# Altium project QSFP28 Mezzanine.PrjPcb (part 4 of 4)
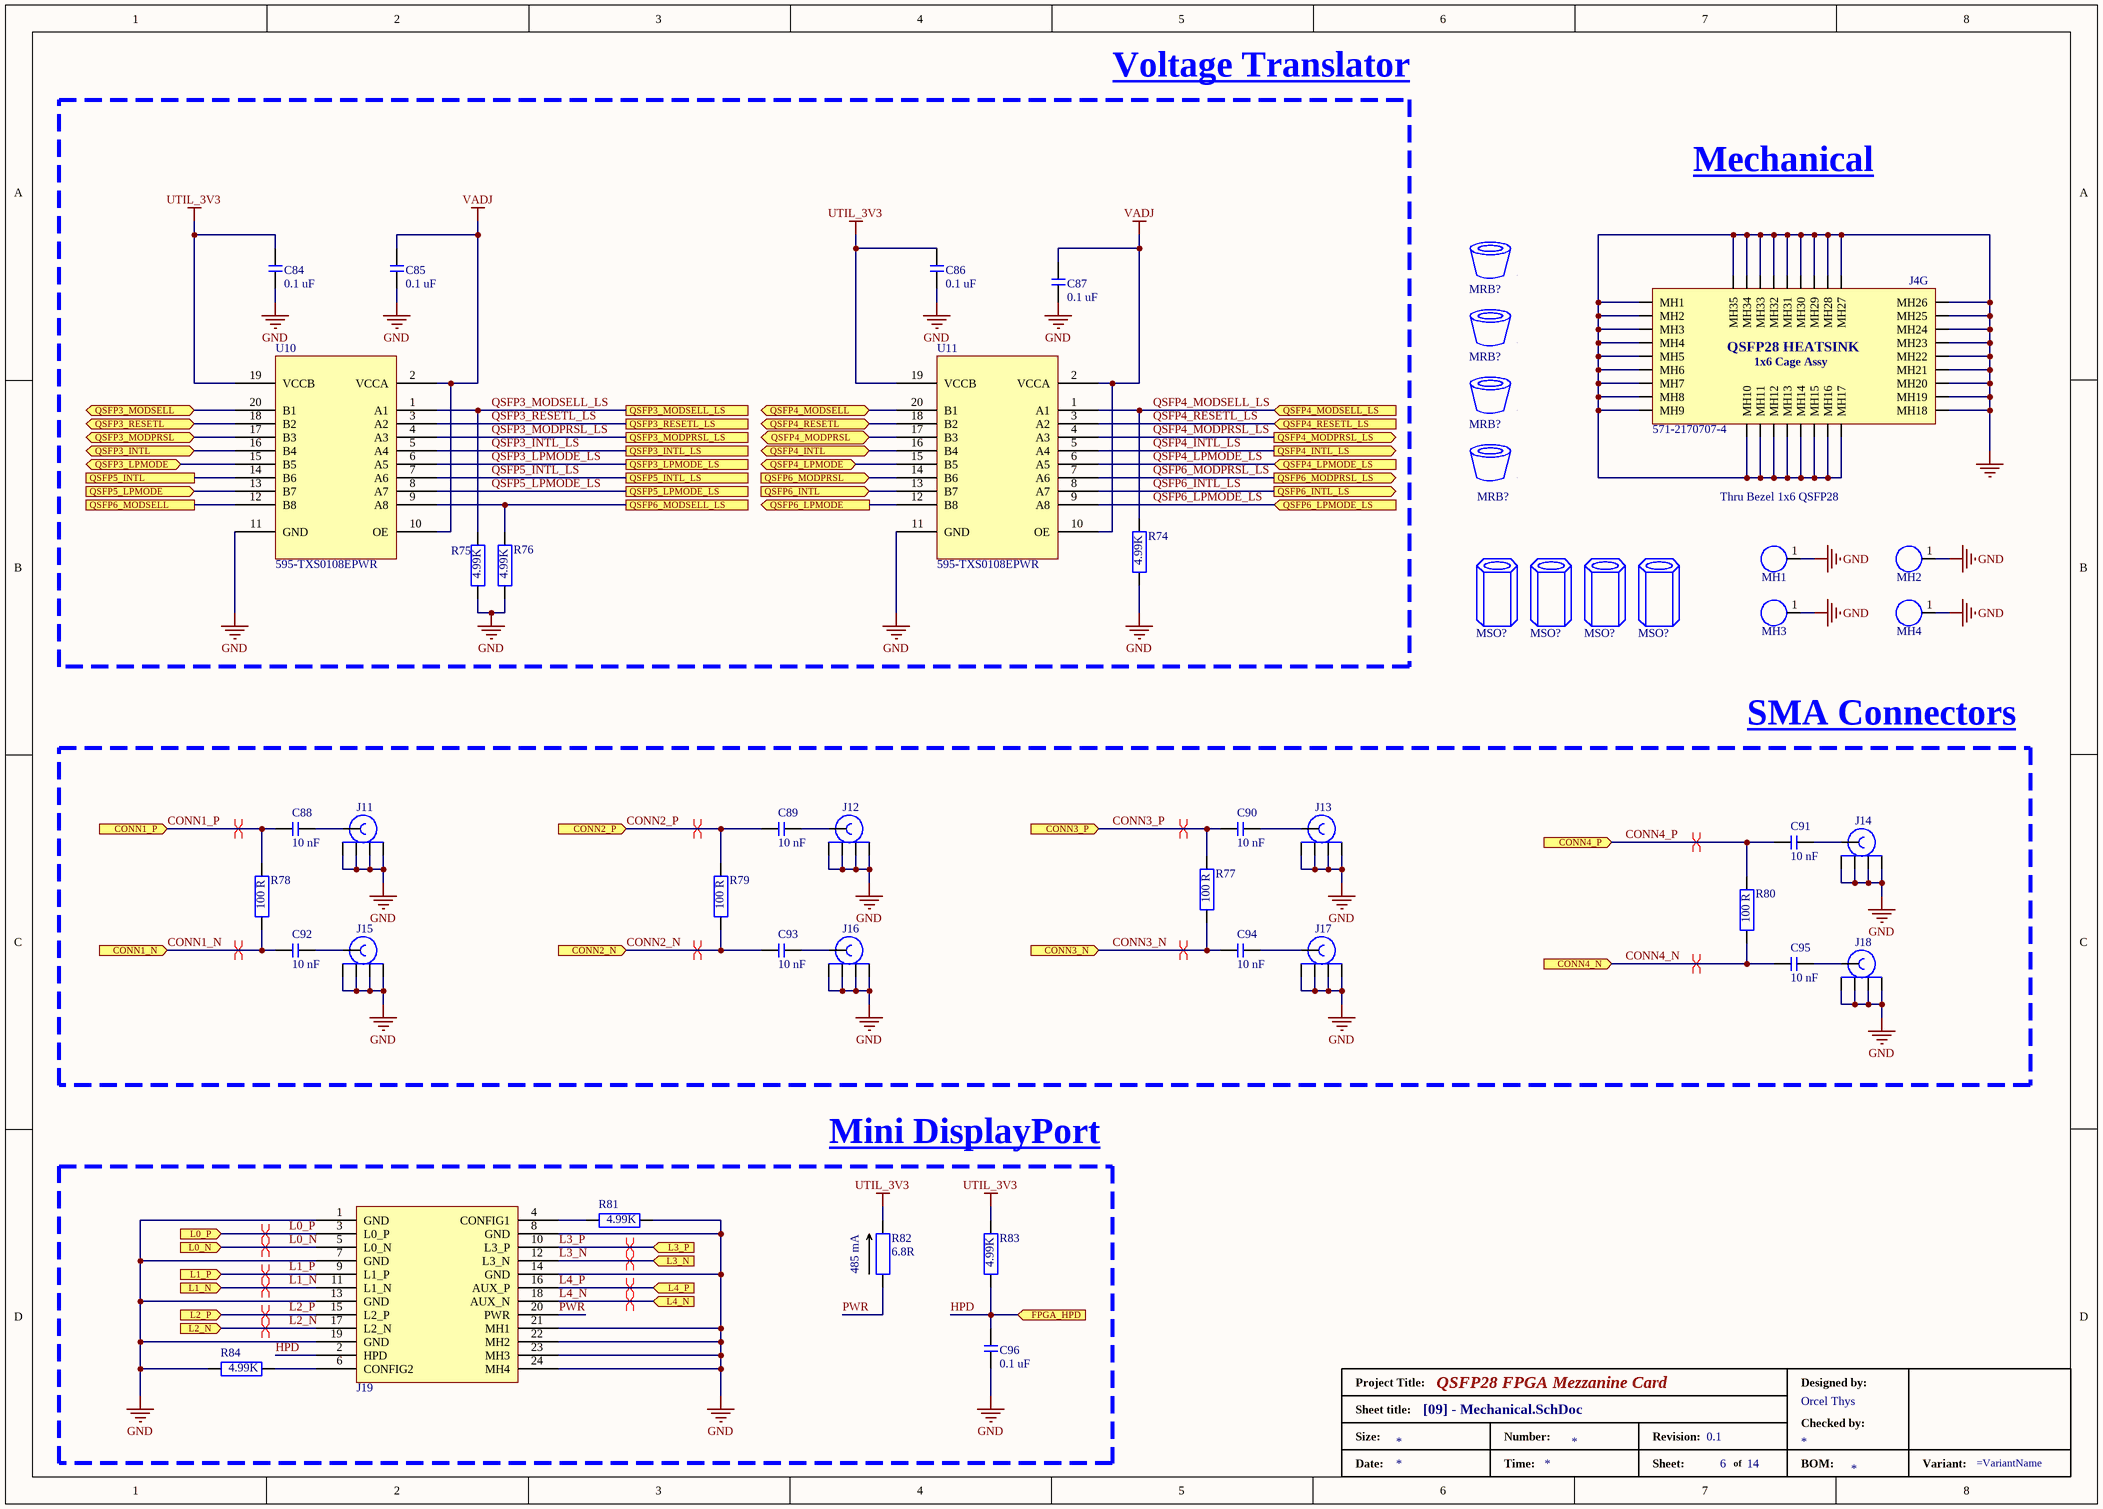
[diagram p9: [09] - Mechanical.SchDoc]

## Nets that join several sheets
GND: [03] - FMCP_1&2 (J1.C34 J1.D35 J1.H2 R1.1), [04] - FMCP_3&4 (239 pins), [05] - I2C (16 pins), [06] - Clock_Management (38 pins), [07] - QSFP28_1 (80 pins), [08] - QSFP28_2 (49 pins), [09] - Mechanical (93 pins)
UTIL_3V3: [03] - FMCP_1&2 (6 pins), [04] - FMCP_3&4 (J1.Z40), [05] - I2C (47 pins), [06] - Clock_Management (5 pins), [07] - QSFP28_1 (32 pins), [08] - QSFP28_2 (20 pins), [09] - Mechanical (6 pins)
VADJ: [03] - FMCP_1&2 (J1.E39 J1.F40 J1.G39 J1.H40), [08] - QSFP28_2 (6 pins), [09] - Mechanical (6 pins)
VCC12_SW: [03] - FMCP_1&2 (J1.C35 J1.C37), [04] - FMCP_3&4 (J1.L36 J1.L37 J1.L40)
CONN1_N: [03] - FMCP_1&2 (J1.H32), [09] - Mechanical (C92.1 R78.1)
CONN1_P: [03] - FMCP_1&2 (J1.H31), [09] - Mechanical (C88.1 R78.2)
CONN2_N: [03] - FMCP_1&2 (J1.H35), [09] - Mechanical (C93.1 R79.1)
CONN2_P: [03] - FMCP_1&2 (J1.H34), [09] - Mechanical (C89.1 R79.2)
CONN3_N: [03] - FMCP_1&2 (J1.H26), [09] - Mechanical (C94.1 R77.1)
CONN3_P: [03] - FMCP_1&2 (J1.H25), [09] - Mechanical (C90.2 R77.2)
CONN4_N: [03] - FMCP_1&2 (J1.D18), [09] - Mechanical (C95.1 R80.1)
CONN4_P: [03] - FMCP_1&2 (J1.D17), [09] - Mechanical (C91.1 R80.2)
HPD: [03] - FMCP_1&2 (J1.H29), [09] - Mechanical (C96.2 J19.2 R83.1)
HSPC_IIC_RESET: [03] - FMCP_1&2 (J1.H37), [05] - I2C (U4.3 U5.3)
HSPC_IIC_SCL: [03] - FMCP_1&2 (J1.C30), [05] - I2C (U4.22 U5.22)
HSPC_IIC_SDA: [03] - FMCP_1&2 (J1.C31), [05] - I2C (U4.23 U5.23)
L0_N: [03] - FMCP_1&2 (J1.G10), [09] - Mechanical (J19.5)
L0_P: [03] - FMCP_1&2 (J1.G9), [09] - Mechanical (J19.3)
L1_N: [03] - FMCP_1&2 (J1.G19), [09] - Mechanical (J19.11)
L1_P: [03] - FMCP_1&2 (J1.G18), [09] - Mechanical (J19.9)
L2_N: [03] - FMCP_1&2 (J1.G25), [09] - Mechanical (J19.17)
L2_P: [03] - FMCP_1&2 (J1.G24), [09] - Mechanical (J19.15)
L3_N: [03] - FMCP_1&2 (J1.G34), [09] - Mechanical (J19.12)
L3_P: [03] - FMCP_1&2 (J1.G33), [09] - Mechanical (J19.10)
L4_N: [03] - FMCP_1&2 (J1.G37), [09] - Mechanical (J19.18)
L4_P: [03] - FMCP_1&2 (J1.G36), [09] - Mechanical (J19.16)
NetJ1_G21: [03] - FMCP_1&2 (J1.G21), [08] - QSFP28_2 (R70.2 U9.7)
NetJ1_H22: [03] - FMCP_1&2 (J1.H22), [08] - QSFP28_2 (U9.9)
NetJ1_H23: [03] - FMCP_1&2 (J1.H23), [08] - QSFP28_2 (U9.8)
NetJ1_H28: [03] - FMCP_1&2 (J1.H28), [09] - Mechanical (R76.2 U10.9)
NetU6_1: [06] - Clock_Management (U6.1 U7.1), [08] - QSFP28_2 (U8.12)
NetU6_3: [06] - Clock_Management (U6.3), [08] - QSFP28_2 (U8.14)
NetU7_3: [06] - Clock_Management (U7.3), [08] - QSFP28_2 (U8.13)
QSFP1_INTL: [07] - QSFP28_1 (J4.A28 R55.1), [08] - QSFP28_2 (U8.16)
QSFP1_INTL_LS: [03] - FMCP_1&2 (J1.H11), [08] - QSFP28_2 (U8.5)
QSFP1_LPMODE: [07] - QSFP28_1 (J4.A31), [08] - QSFP28_2 (U8.15)
QSFP1_LPMODE_LS: [03] - FMCP_1&2 (J1.H10), [08] - QSFP28_2 (U8.6)
QSFP1_MODPRSL: [07] - QSFP28_1 (J4.A27 R54.1), [08] - QSFP28_2 (U8.17)
QSFP1_MODPRSL_LS: [03] - FMCP_1&2 (J1.H16), [08] - QSFP28_2 (U8.4)
QSFP1_MODSELL: [07] - QSFP28_1 (J4.A8), [08] - QSFP28_2 (U8.20)
QSFP1_MODSELL_LS: [03] - FMCP_1&2 (J1.C14), [08] - QSFP28_2 (U8.1)
QSFP1_REFCLK_N: [03] - FMCP_1&2 (J1.G7), [06] - Clock_Management (C14.1 R45.1)
QSFP1_REFCLK_P: [03] - FMCP_1&2 (J1.G6), [06] - Clock_Management (C8.1 R45.2)
QSFP1_RESETL: [07] - QSFP28_1 (J4.A9 R53.1), [08] - QSFP28_2 (U8.18)
QSFP1_RESETL_LS: [03] - FMCP_1&2 (J1.H17), [08] - QSFP28_2 (R68.2 U8.3)
QSFP1_RX1_N: [04] - FMCP_3&4 (J1.M15), [07] - QSFP28_1 (J4.A18)
QSFP1_RX1_P: [04] - FMCP_3&4 (J1.M14), [07] - QSFP28_1 (J4.A17)
QSFP1_RX2_N: [04] - FMCP_3&4 (J1.M11), [07] - QSFP28_1 (J4.A21)
QSFP1_RX2_P: [04] - FMCP_3&4 (J1.M10), [07] - QSFP28_1 (J4.A22)
QSFP1_RX3_N: [04] - FMCP_3&4 (J1.M7), [07] - QSFP28_1 (J4.A15)
QSFP1_RX3_P: [04] - FMCP_3&4 (J1.M6), [07] - QSFP28_1 (J4.A14)
QSFP1_RX4_N: [04] - FMCP_3&4 (J1.M3), [07] - QSFP28_1 (J4.A24)
QSFP1_RX4_P: [04] - FMCP_3&4 (J1.M2), [07] - QSFP28_1 (J4.A25)
QSFP1_SCL: [05] - I2C (R15.1 U4.5), [07] - QSFP28_1 (J4.A11)
QSFP1_SDA: [05] - I2C (R16.1 U4.4), [07] - QSFP28_1 (J4.A12)
QSFP1_TX1_N: [04] - FMCP_3&4 (J1.Z9), [07] - QSFP28_1 (J4.A37)
QSFP1_TX1_P: [04] - FMCP_3&4 (J1.Z8), [07] - QSFP28_1 (J4.A36)
QSFP1_TX2_N: [04] - FMCP_3&4 (J1.Y7), [07] - QSFP28_1 (J4.A2)
QSFP1_TX2_P: [04] - FMCP_3&4 (J1.Y6), [07] - QSFP28_1 (J4.A3)
QSFP1_TX3_N: [04] - FMCP_3&4 (J1.Z5), [07] - QSFP28_1 (J4.A34)
QSFP1_TX3_P: [04] - FMCP_3&4 (J1.Z4), [07] - QSFP28_1 (J4.A33)
QSFP1_TX4_N: [04] - FMCP_3&4 (J1.Y3), [07] - QSFP28_1 (J4.A5)
QSFP1_TX4_P: [04] - FMCP_3&4 (J1.Y2), [07] - QSFP28_1 (J4.A6)
QSFP2_INTL: [07] - QSFP28_1 (J4.B28 R58.1), [08] - QSFP28_2 (U9.16)
QSFP2_INTL_LS: [03] - FMCP_1&2 (J1.D15), [08] - QSFP28_2 (U9.5)
QSFP2_LPMODE: [07] - QSFP28_1 (J4.B31), [08] - QSFP28_2 (U9.15)
QSFP2_LPMODE_LS: [03] - FMCP_1&2 (J1.D14), [08] - QSFP28_2 (U9.6)
QSFP2_MODPRSL: [07] - QSFP28_1 (J4.B27 R57.1), [08] - QSFP28_2 (U9.17)
QSFP2_MODPRSL_LS: [03] - FMCP_1&2 (J1.G12), [08] - QSFP28_2 (U9.4)
QSFP2_MODSELL: [07] - QSFP28_1 (J4.B8), [08] - QSFP28_2 (U9.20)
QSFP2_MODSELL_LS: [03] - FMCP_1&2 (J1.C18), [08] - QSFP28_2 (R69.2 U9.1)
QSFP2_REFCLK_N: [03] - FMCP_1&2 (J1.D9), [06] - Clock_Management (C18.1 R46.1)
QSFP2_REFCLK_P: [03] - FMCP_1&2 (J1.D8), [06] - Clock_Management (C16.1 R46.2)
QSFP2_RESETL: [07] - QSFP28_1 (J4.B9 R56.1), [08] - QSFP28_2 (U9.18)
QSFP2_RESETL_LS: [03] - FMCP_1&2 (J1.G13), [08] - QSFP28_2 (U9.3)
QSFP2_RX1_N: [04] - FMCP_3&4 (J1.Z33), [07] - QSFP28_1 (J4.B18)
QSFP2_RX1_P: [04] - FMCP_3&4 (J1.Z32), [07] - QSFP28_1 (J4.B17)
QSFP2_RX2_N: [04] - FMCP_3&4 (J1.Y35), [07] - QSFP28_1 (J4.B21)
QSFP2_RX2_P: [04] - FMCP_3&4 (J1.Y34), [07] - QSFP28_1 (J4.B22)
QSFP2_RX3_N: [04] - FMCP_3&4 (J1.Z37), [07] - QSFP28_1 (J4.B15)
QSFP2_RX3_P: [04] - FMCP_3&4 (J1.Z36), [07] - QSFP28_1 (J4.B14)
QSFP2_RX4_N: [04] - FMCP_3&4 (J1.Y39), [07] - QSFP28_1 (J4.B24)
QSFP2_RX4_P: [04] - FMCP_3&4 (J1.Y38), [07] - QSFP28_1 (J4.B25)
QSFP2_SCL: [05] - I2C (R13.1 U4.7), [07] - QSFP28_1 (J4.B11)
QSFP2_SDA: [05] - I2C (R14.1 U4.6), [07] - QSFP28_1 (J4.B12)
QSFP2_Si570_CLOCK_N: [04] - FMCP_3&4 (J1.L13), [05] - I2C (U1.5)
QSFP2_Si570_CLOCK_P: [04] - FMCP_3&4 (J1.L12), [05] - I2C (U1.4)
QSFP2_TX1_N: [04] - FMCP_3&4 (J1.M27), [07] - QSFP28_1 (J4.B37)
QSFP2_TX1_P: [04] - FMCP_3&4 (J1.M26), [07] - QSFP28_1 (J4.B36)
QSFP2_TX2_N: [04] - FMCP_3&4 (J1.M31), [07] - QSFP28_1 (J4.B2)
QSFP2_TX2_P: [04] - FMCP_3&4 (J1.M30), [07] - QSFP28_1 (J4.B3)
QSFP2_TX3_N: [04] - FMCP_3&4 (J1.M35), [07] - QSFP28_1 (J4.B34)
QSFP2_TX3_P: [04] - FMCP_3&4 (J1.M34), [07] - QSFP28_1 (J4.B33)
QSFP2_TX4_N: [04] - FMCP_3&4 (J1.M39), [07] - QSFP28_1 (J4.B5)
QSFP2_TX4_P: [04] - FMCP_3&4 (J1.M38), [07] - QSFP28_1 (J4.B6)
QSFP3_INTL: [07] - QSFP28_1 (J4.C28 R61.1), [09] - Mechanical (U10.16)
QSFP3_INTL_LS: [03] - FMCP_1&2 (J1.G16), [09] - Mechanical (U10.5)
QSFP3_LPMODE: [07] - QSFP28_1 (J4.C31), [09] - Mechanical (U10.15)
QSFP3_LPMODE_LS: [03] - FMCP_1&2 (J1.G15), [09] - Mechanical (U10.6)
QSFP3_MODPRSL: [07] - QSFP28_1 (J4.C27 R60.1), [09] - Mechanical (U10.17)
QSFP3_MODPRSL_LS: [03] - FMCP_1&2 (J1.D11), [09] - Mechanical (U10.4)
QSFP3_MODSELL: [07] - QSFP28_1 (J4.C8), [09] - Mechanical (U10.20)
QSFP3_MODSELL_LS: [03] - FMCP_1&2 (J1.C10), [09] - Mechanical (R75.2 U10.1)
QSFP3_REFCLK_N: [03] - FMCP_1&2 (J1.D21), [06] - Clock_Management (C26.1 R49.1)
QSFP3_REFCLK_P: [03] - FMCP_1&2 (J1.D20), [06] - Clock_Management (C25.1 R49.2)
QSFP3_RESETL: [07] - QSFP28_1 (J4.C9 R59.1), [09] - Mechanical (U10.18)
QSFP3_RESETL_LS: [03] - FMCP_1&2 (J1.D12), [09] - Mechanical (U10.3)
QSFP3_RX1_N: [04] - FMCP_3&4 (J1.Y15), [07] - QSFP28_1 (J4.C18)
QSFP3_RX1_P: [04] - FMCP_3&4 (J1.Y14), [07] - QSFP28_1 (J4.C17)
QSFP3_RX2_N: [04] - FMCP_3&4 (J1.Z17), [07] - QSFP28_1 (J4.C21)
QSFP3_RX2_P: [04] - FMCP_3&4 (J1.Z16), [07] - QSFP28_1 (J4.C22)
QSFP3_RX3_N: [04] - FMCP_3&4 (J1.Y19), [07] - QSFP28_1 (J4.C15)
QSFP3_RX3_P: [04] - FMCP_3&4 (J1.Y18), [07] - QSFP28_1 (J4.C14)
QSFP3_RX4_N: [04] - FMCP_3&4 (J1.Y23), [07] - QSFP28_1 (J4.C24)
QSFP3_RX4_P: [04] - FMCP_3&4 (J1.Y22), [07] - QSFP28_1 (J4.C25)
QSFP3_SCL: [05] - I2C (R11.1 U4.9), [07] - QSFP28_1 (J4.C11)
QSFP3_SDA: [05] - I2C (R12.1 U4.8), [07] - QSFP28_1 (J4.C12)
QSFP3_Si570_CLOCK_N: [04] - FMCP_3&4 (J1.L9), [05] - I2C (U2.5)
QSFP3_Si570_CLOCK_P: [04] - FMCP_3&4 (J1.L8), [05] - I2C (U2.4)
QSFP3_TX1_N: [04] - FMCP_3&4 (J1.Z29), [07] - QSFP28_1 (J4.C37)
QSFP3_TX1_P: [04] - FMCP_3&4 (J1.Z28), [07] - QSFP28_1 (J4.C36)
QSFP3_TX2_N: [04] - FMCP_3&4 (J1.Y31), [07] - QSFP28_1 (J4.C2)
QSFP3_TX2_P: [04] - FMCP_3&4 (J1.Y30), [07] - QSFP28_1 (J4.C3)
QSFP3_TX3_N: [04] - FMCP_3&4 (J1.M19), [07] - QSFP28_1 (J4.C34)
QSFP3_TX3_P: [04] - FMCP_3&4 (J1.M18), [07] - QSFP28_1 (J4.C33)
QSFP3_TX4_N: [04] - FMCP_3&4 (J1.M23), [07] - QSFP28_1 (J4.C5)
QSFP3_TX4_P: [04] - FMCP_3&4 (J1.M22), [07] - QSFP28_1 (J4.C6)
QSFP4_INTL: [07] - QSFP28_1 (J4.D28 R64.1), [09] - Mechanical (U11.16)
QSFP4_INTL_LS: [03] - FMCP_1&2 (J1.H8), [09] - Mechanical (U11.5)
QSFP4_LPMODE: [07] - QSFP28_1 (J4.D31), [09] - Mechanical (U11.15)
QSFP4_LPMODE_LS: [03] - FMCP_1&2 (J1.H7), [09] - Mechanical (U11.6)
QSFP4_MODPRSL: [07] - QSFP28_1 (J4.D27 R63.1), [09] - Mechanical (U11.17)
QSFP4_MODPRSL_LS: [03] - FMCP_1&2 (J1.H13), [09] - Mechanical (U11.4)
QSFP4_MODSELL: [07] - QSFP28_1 (J4.D8), [09] - Mechanical (U11.20)
QSFP4_MODSELL_LS: [03] - FMCP_1&2 (J1.H19), [09] - Mechanical (R74.2 U11.1)
QSFP4_REFCLK_N: [03] - FMCP_1&2 (J1.C23), [06] - Clock_Management (C30.1 R51.1)
QSFP4_REFCLK_P: [03] - FMCP_1&2 (J1.C22), [06] - Clock_Management (C28.1 R51.2)
QSFP4_RESETL: [07] - QSFP28_1 (J4.D9 R62.1), [09] - Mechanical (U11.18)
QSFP4_RESETL_LS: [03] - FMCP_1&2 (J1.H14), [09] - Mechanical (U11.3)
QSFP4_RX1_N: [03] - FMCP_1&2 (J1.B9), [07] - QSFP28_1 (J4.D18)
QSFP4_RX1_P: [03] - FMCP_1&2 (J1.B8), [07] - QSFP28_1 (J4.D17)
QSFP4_RX2_N: [03] - FMCP_1&2 (J1.B5), [07] - QSFP28_1 (J4.D21)
QSFP4_RX2_P: [03] - FMCP_1&2 (J1.B4), [07] - QSFP28_1 (J4.D22)
QSFP4_RX3_N: [04] - FMCP_3&4 (J1.Y11), [07] - QSFP28_1 (J4.D15)
QSFP4_RX3_P: [04] - FMCP_3&4 (J1.Y10), [07] - QSFP28_1 (J4.D14)
QSFP4_RX4_N: [04] - FMCP_3&4 (J1.Z13), [07] - QSFP28_1 (J4.D24)
QSFP4_RX4_P: [04] - FMCP_3&4 (J1.Z12), [07] - QSFP28_1 (J4.D25)
QSFP4_SCL: [05] - I2C (R9.1 U4.11), [07] - QSFP28_1 (J4.D11)
QSFP4_SDA: [05] - I2C (R10.1 U4.10), [07] - QSFP28_1 (J4.D12)
QSFP4_Si570_CLOCK_N: [04] - FMCP_3&4 (J1.L5), [05] - I2C (U3.5)
QSFP4_Si570_CLOCK_P: [04] - FMCP_3&4 (J1.L4), [05] - I2C (U3.4)
QSFP4_TX1_N: [03] - FMCP_1&2 (J1.B29), [07] - QSFP28_1 (J4.D37)
QSFP4_TX1_P: [03] - FMCP_1&2 (J1.B28), [07] - QSFP28_1 (J4.D36)
QSFP4_TX2_N: [03] - FMCP_1&2 (J1.B25), [07] - QSFP28_1 (J4.D2)
QSFP4_TX2_P: [03] - FMCP_1&2 (J1.B24), [07] - QSFP28_1 (J4.D3)
QSFP4_TX3_N: [04] - FMCP_3&4 (J1.Z25), [07] - QSFP28_1 (J4.D34)
QSFP4_TX3_P: [04] - FMCP_3&4 (J1.Z24), [07] - QSFP28_1 (J4.D33)
QSFP4_TX4_N: [04] - FMCP_3&4 (J1.Y27), [07] - QSFP28_1 (J4.D5)
QSFP4_TX4_P: [04] - FMCP_3&4 (J1.Y26), [07] - QSFP28_1 (J4.D6)
QSFP5_INTL: [08] - QSFP28_2 (J4.E28 R67.1), [09] - Mechanical (U10.14)
QSFP5_INTL_LS: [03] - FMCP_1&2 (J1.D24), [09] - Mechanical (U10.7)
QSFP5_LPMODE: [08] - QSFP28_2 (J4.E31), [09] - Mechanical (U10.13)
QSFP5_LPMODE_LS: [03] - FMCP_1&2 (J1.D23), [09] - Mechanical (U10.8)
QSFP5_RX1_N: [03] - FMCP_1&2 (J1.A15), [08] - QSFP28_2 (J4.E18)
QSFP5_RX1_P: [03] - FMCP_1&2 (J1.A14), [08] - QSFP28_2 (J4.E17)
QSFP5_RX2_N: [03] - FMCP_1&2 (J1.A19), [08] - QSFP28_2 (J4.E21)
QSFP5_RX2_P: [03] - FMCP_1&2 (J1.A18), [08] - QSFP28_2 (J4.E22)
QSFP5_RX3_N: [03] - FMCP_1&2 (J1.B17), [08] - QSFP28_2 (J4.E15)
QSFP5_RX3_P: [03] - FMCP_1&2 (J1.B16), [08] - QSFP28_2 (J4.E14)
QSFP5_RX4_N: [03] - FMCP_1&2 (J1.B13), [08] - QSFP28_2 (J4.E24)
QSFP5_RX4_P: [03] - FMCP_1&2 (J1.B12), [08] - QSFP28_2 (J4.E25)
QSFP5_SCL: [05] - I2C (R7.1 U4.14), [08] - QSFP28_2 (J4.E11)
QSFP5_SDA: [05] - I2C (R8.1 U4.13), [08] - QSFP28_2 (J4.E12)
QSFP5_TX1_N: [03] - FMCP_1&2 (J1.A35), [08] - QSFP28_2 (J4.E37)
QSFP5_TX1_P: [03] - FMCP_1&2 (J1.A34), [08] - QSFP28_2 (J4.E36)
QSFP5_TX2_N: [03] - FMCP_1&2 (J1.A39), [08] - QSFP28_2 (J4.E2)
QSFP5_TX2_P: [03] - FMCP_1&2 (J1.A38), [08] - QSFP28_2 (J4.E3)
QSFP5_TX3_N: [03] - FMCP_1&2 (J1.B37), [08] - QSFP28_2 (J4.E34)
QSFP5_TX3_P: [03] - FMCP_1&2 (J1.B36), [08] - QSFP28_2 (J4.E33)
QSFP5_TX4_N: [03] - FMCP_1&2 (J1.B33), [08] - QSFP28_2 (J4.E5)
QSFP5_TX4_P: [03] - FMCP_1&2 (J1.B32), [08] - QSFP28_2 (J4.E6)
QSFP6_INTL: [08] - QSFP28_2 (J4.F28 R73.1), [09] - Mechanical (U11.13)
QSFP6_INTL_LS: [03] - FMCP_1&2 (J1.D27), [09] - Mechanical (U11.8)
QSFP6_LPMODE: [08] - QSFP28_2 (J4.F31), [09] - Mechanical (U11.12)
QSFP6_LPMODE_LS: [03] - FMCP_1&2 (J1.D26), [09] - Mechanical (U11.9)
QSFP6_MODPRSL: [08] - QSFP28_2 (J4.F27 R72.1), [09] - Mechanical (U11.14)
QSFP6_MODPRSL_LS: [03] - FMCP_1&2 (J1.G27), [09] - Mechanical (U11.7)
QSFP6_MODSELL: [08] - QSFP28_2 (J4.F8), [09] - Mechanical (U10.12)
QSFP6_RX1_N: [03] - FMCP_1&2 (J1.C7), [08] - QSFP28_2 (J4.F18)
QSFP6_RX1_P: [03] - FMCP_1&2 (J1.C6), [08] - QSFP28_2 (J4.F17)
QSFP6_RX2_N: [03] - FMCP_1&2 (J1.A3), [08] - QSFP28_2 (J4.F21)
QSFP6_RX2_P: [03] - FMCP_1&2 (J1.A2), [08] - QSFP28_2 (J4.F22)
QSFP6_RX3_N: [03] - FMCP_1&2 (J1.A7), [08] - QSFP28_2 (J4.F15)
QSFP6_RX3_P: [03] - FMCP_1&2 (J1.A6), [08] - QSFP28_2 (J4.F14)
QSFP6_RX4_N: [03] - FMCP_1&2 (J1.A11), [08] - QSFP28_2 (J4.F24)
QSFP6_RX4_P: [03] - FMCP_1&2 (J1.A10), [08] - QSFP28_2 (J4.F25)
QSFP6_SCL: [05] - I2C (R5.1 U4.16), [08] - QSFP28_2 (J4.F11)
QSFP6_SDA: [05] - I2C (R6.1 U4.15), [08] - QSFP28_2 (J4.F12)
QSFP6_TX1_N: [03] - FMCP_1&2 (J1.C3), [08] - QSFP28_2 (J4.F37)
QSFP6_TX1_P: [03] - FMCP_1&2 (J1.C2), [08] - QSFP28_2 (J4.F36)
QSFP6_TX2_N: [03] - FMCP_1&2 (J1.A23), [08] - QSFP28_2 (J4.F2)
QSFP6_TX2_P: [03] - FMCP_1&2 (J1.A22), [08] - QSFP28_2 (J4.F3)
QSFP6_TX3_N: [03] - FMCP_1&2 (J1.A27), [08] - QSFP28_2 (J4.F34)
QSFP6_TX3_P: [03] - FMCP_1&2 (J1.A26), [08] - QSFP28_2 (J4.F33)
QSFP6_TX4_N: [03] - FMCP_1&2 (J1.A31), [08] - QSFP28_2 (J4.F5)
QSFP6_TX4_P: [03] - FMCP_1&2 (J1.A30), [08] - QSFP28_2 (J4.F6)
Si5328_CLOCK1_N: [04] - FMCP_3&4 (J1.Z21), [06] - Clock_Management (C13.2)
Si5328_CLOCK1_P: [04] - FMCP_3&4 (J1.Z20), [06] - Clock_Management (C7.2)
Si5328_CLOCK2_N: [03] - FMCP_1&2 (J1.B21), [06] - Clock_Management (C17.2)
Si5328_CLOCK2_P: [03] - FMCP_1&2 (J1.B20), [06] - Clock_Management (C15.2)
Si5328_CLOCK3_N: [03] - FMCP_1&2 (J1.D5), [06] - Clock_Management (C27.2)
Si5328_CLOCK3_P: [03] - FMCP_1&2 (J1.D4), [06] - Clock_Management (C24.2)
SI5328_INT_ALM_LS1: [03] - FMCP_1&2 (J1.G31), [08] - QSFP28_2 (U8.7)
SI5328_INT_ALM_LS2: [03] - FMCP_1&2 (J1.H38), [08] - QSFP28_2 (U8.8)
SI5328_RST_B_LS2: [03] - FMCP_1&2 (J1.G30), [08] - QSFP28_2 (U8.9)
Si5328_SCL1: [05] - I2C (R25.1 U5.18), [06] - Clock_Management (U6.22)
Si5328_SCL2: [05] - I2C (R23.1 U5.20), [06] - Clock_Management (U7.22)
Si5328_SDA1: [05] - I2C (R26.1 U5.17), [06] - Clock_Management (U6.23)
Si5328_SDA2: [05] - I2C (R24.1 U5.19), [06] - Clock_Management (U7.23)